# EAGLE design PIC32pcbSchematicJones (EAGLE 8.1.0)
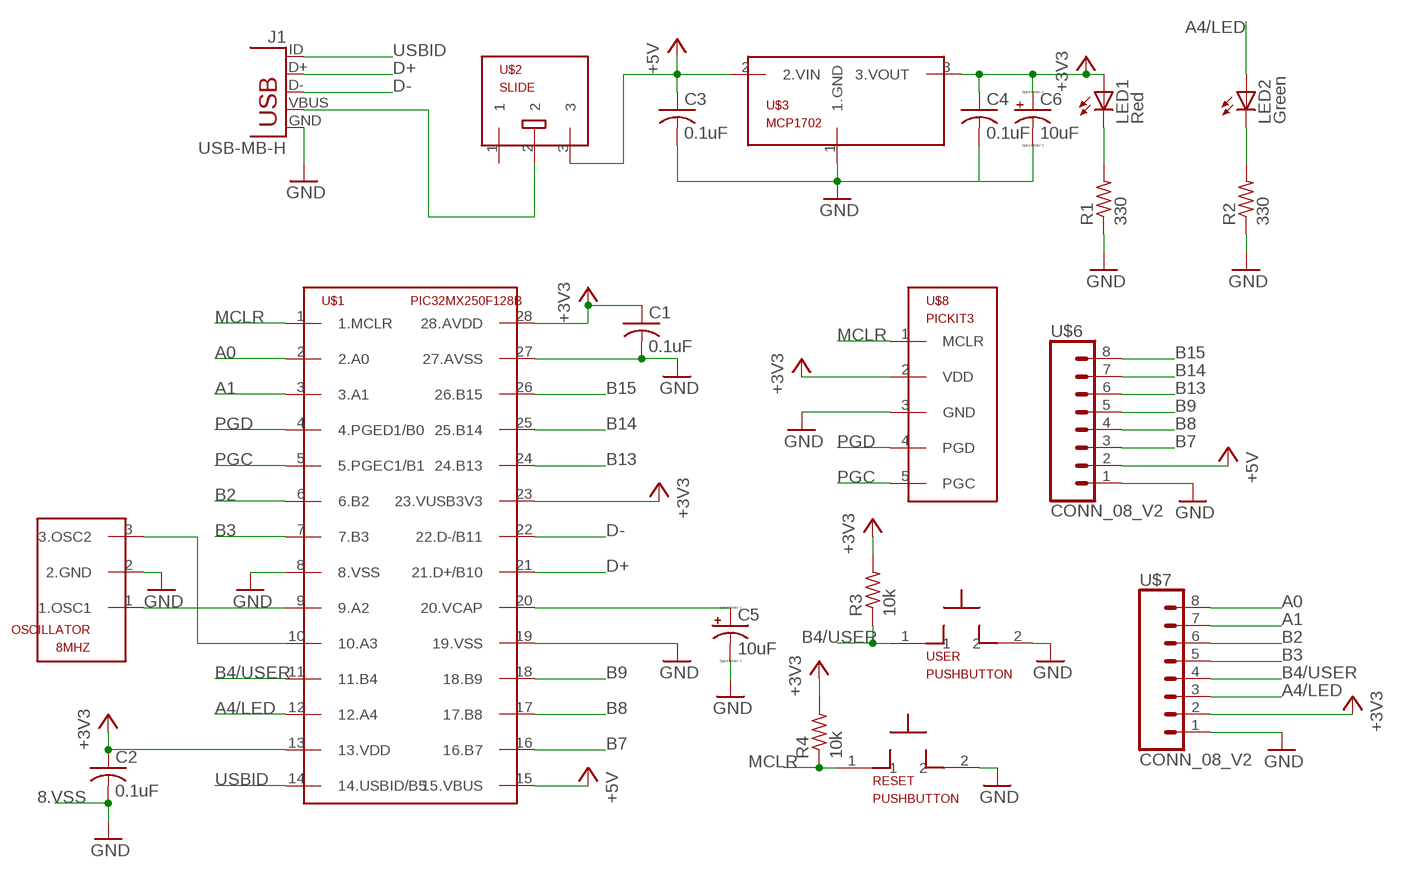
[diagram p0: schematic, sheet 1]

## Parts
8MHZ  OSCILLATOR  [OSCILLATOR]
C1  0.1uF  C-US025-025X050  [C025-025X050]
C2  0.1uF  C-US025-025X050  [C025-025X050]
C3  0.1uF  C-US025-025X050  [C025-025X050]
C4  0.1uF  C-US025-025X050  [C025-025X050]
C5  10uF  CPOL-USB45181B  [B45181B]
C6  10uF  CPOL-USB45181B  [B45181B]
J1  USB-MB-H  [USB-MB-H]
LED1  Red  LED3MM  [LED3MM]
LED2  Green  LED3MM  [LED3MM]
R1  330  R-US_0207/10  [0207/10]
R2  330  R-US_0207/10  [0207/10]
R3  10k  R-US_0207/10  [0207/10]
R4  10k  R-US_0207/10  [0207/10]
RESET  PUSHBUTTON  [PUSHBUTTON]
U$1  PIC32MX250F128B  [DIL28-3]
U$2  SLIDE  [SLIDE]
U$3  MCP1702  [TO92]
U$6  CONN_08_V2  [1X08]
U$7  CONN_08_V2  [1X08]
U$8  PICKIT3  [1X05]
USER  PUSHBUTTON  [PUSHBUTTON]

## Nets
8.VSS: C2.2 ; supply symbol labelled GND
+3V3: C1.1 C2.1 C4.1 C6.+ LED1.A R3.2 R4.2 U$1.13(13.VDD) U$1.23(23.VUSB3V3) U$1.28(28.AVDD) U$3.3(3.VOUT) U$7.2 U$8.2(VDD)
+5V: C3.1 U$1.15(15.VBUS) U$2.3 U$3.2(2.VIN) U$6.2
A0: U$1.2(2.A0) U$7.8
A1: U$1.3(3.A1) U$7.7
A4/LED: LED2.A U$1.12(12.A4) U$7.3
B2: U$1.6(6.B2) U$7.6
B3: U$1.7(7.B3) U$7.5
B4/USER: R3.1 U$1.11(11.B4) U$7.4 USER.1
B7: U$1.16(16.B7) U$6.3
B8: U$1.17(17.B8) U$6.4
B9: U$1.18(18.B9) U$6.5
B13: U$1.24(24.B13) U$6.6
B14: U$1.25(25.B14) U$6.7
B15: U$1.26(26.B15) U$6.8
D+: J1.D+ U$1.21(21.D+/B10)
D-: J1.D- U$1.22(22.D-/B11)
GND: 8MHZ.2(2.GND) C1.2 C3.2 C5.- C6.- J1.GND R1.1 R2.1 RESET.2 U$1.8(8.VSS) U$1.19(19.VSS) U$1.27(27.AVSS) U$3.1(1.GND) U$6.1 U$7.1 U$8.3(GND) USER.2
MCLR: R4.1 RESET.1 U$1.1(1.MCLR) U$8.1(MCLR)
N$1: LED2.K(C) R2.2
N$2: 8MHZ.1(1.OSC1) U$1.9(9.A2)
N$3: 8MHZ.3(3.OSC2) U$1.10(10.A3)
N$4: C5.+ U$1.20(20.VCAP)
N$5: LED1.K(C) R1.2
N$6: C4.2
PGC: U$1.5(5.PGEC1/B1) U$8.5(PGC)
PGD: U$1.4(4.PGED1/B0) U$8.4(PGD)
USBID: J1.ID U$1.14(14.USBID/B5)
VBUS: J1.VBUS U$2.2
Unconnected: U$2.1

## Library data of the parts
8MHZ = PIC32_PCB_Jones_433:OSCILLATOR
C1-C4 = PIC32_PCB_Jones_433:C-US: CAPACITOR, American symbol
C5 C6 = PIC32_PCB_Jones_433:CPOL-US: POLARIZED CAPACITOR, American symbol
J1 = PIC32_PCB_Jones_433:USB: USB Connectors USB-B-PTH is fully proven SKU : PRT-00139/CONN-08278 USB-miniB is fully proven SKU : PRT-00587 USB-A-PCB is untested. USB-A-H is throughly reviewed, but untested. Spark Fun Electronics SKU : PRT-00437 USB-B-SMT is throughly reviewed, but untested. Needs silkscreen touching up. USB-A-S has not been used/tested USB-MB-H has not been used/tested USB-MICROB has been used. CONN-09505
LED1 LED2 = PIC32_PCB_Jones_433:LED: LED OSRAM: - CHIPLED LG R971, LG N971, LY N971, LG Q971, LY Q971, LO R971, LY R971 LH N974, LH R974 LS Q976, LO Q976, LY Q976 LO Q996 - Hyper CHIPLED LW Q18S LB Q993, LB Q99A, LB R99A - SideLED LS A670, LO A670, LY A670, LG A670, LP A670 LB A673, LV A673, LT A673, LW A673 LH A674 LY A675 LS A676, LA A676, LO A676, LY A676, LW A676 LS A679, LY A679, LG A679 - Hyper Micro SIDELED® LS Y876, LA Y876, LO Y876, LY Y876 LT Y87S - SmartLED LW L88C, LW L88S LB L89C, LB L89S, LG L890 LS L89K, LO L89K, LY L89K LS L896, LA L896, LO L896, LY L896 - TOPLED LS T670, LO T670, LY T670, LG T670, LP T670 LSG T670, LSP T670, LSY T670, LOP T670, LYG T670 LG T671, LOG T671, LSG T671 LB T673, LV T673, LT T673, LW T673 LH T674 LS T676, LA T676, LO T676, LY T676, LB T676, LH T676, LSB T676, LW T676 LB T67C, LV T67C, LT T67C, LS T67K, LO T67K, LY T67K, LW E67C LS E67B, LA E67B, LO E67B, LY E67B, LB E67C, LV E67C, LT E67C LW T67C LS T679, LY T679, LG T679 LS T770, LO T770, LY T770, LG T770, LP T770 LB T773, LV T773, LT T773, LW T773 LH T774 LS E675, LA E675, LY E675, LS T675 LS T776, LA T776, LO T776, LY T776, LB T776 LHGB T686 LT T68C, LB T68C - Hyper Mini TOPLED® LB M676 - Mini TOPLED Santana® LG M470 LS M47K, LO M47K, LY M47K Source: http://www.osram.convergy.de LUXEON: - LUMILED® LXK2-PW12-R00, LXK2-PW12-S00, LXK2-PW14-U00, LXK2-PW14-V00 LXK2-PM12-R00, LXK2-PM12-S00, LXK2-PM14-U00 LXK2-PE12-Q00, LXK2-PE12-R00, LXK2-PE12-S00, LXK2-PE14-T00, LXK2-PE14-U00 LXK2-PB12-K00, LXK2-PB12-L00, LXK2-PB12-M00, LXK2-PB14-N00, LXK2-PB14-P00, LXK2-PB14-Q00 LXK2-PR12-L00, LXK2-PR12-M00, LXK2-PR14-Q00, LXK2-PR14-R00 LXK2-PD12-Q00, LXK2-PD12-R00, LXK2-PD12-S00 LXK2-PH12-R00, LXK2-PH12-S00 LXK2-PL12-P00, LXK2-PL12-Q00, LXK2-PL12-R00 Source: www.luxeon.com KINGBRIGHT: KA-3528ASYC Source: www.kingbright.com
R1-R4 = PIC32_PCB_Jones_433:R-US_: RESISTOR, American symbol
RESET USER = PIC32_PCB_Jones_433:PUSHBUTTON
U$1 = PIC32_PCB_Jones_433:PIC32MX250F128B
U$2 = PIC32_PCB_Jones_433:SLIDE
U$3 = PIC32_PCB_Jones_433:MCP1702
U$6 U$7 = PIC32_PCB_Jones_433:CONN_08_V2
U$8 = PIC32_PCB_Jones_433:PICKIT3

## Board
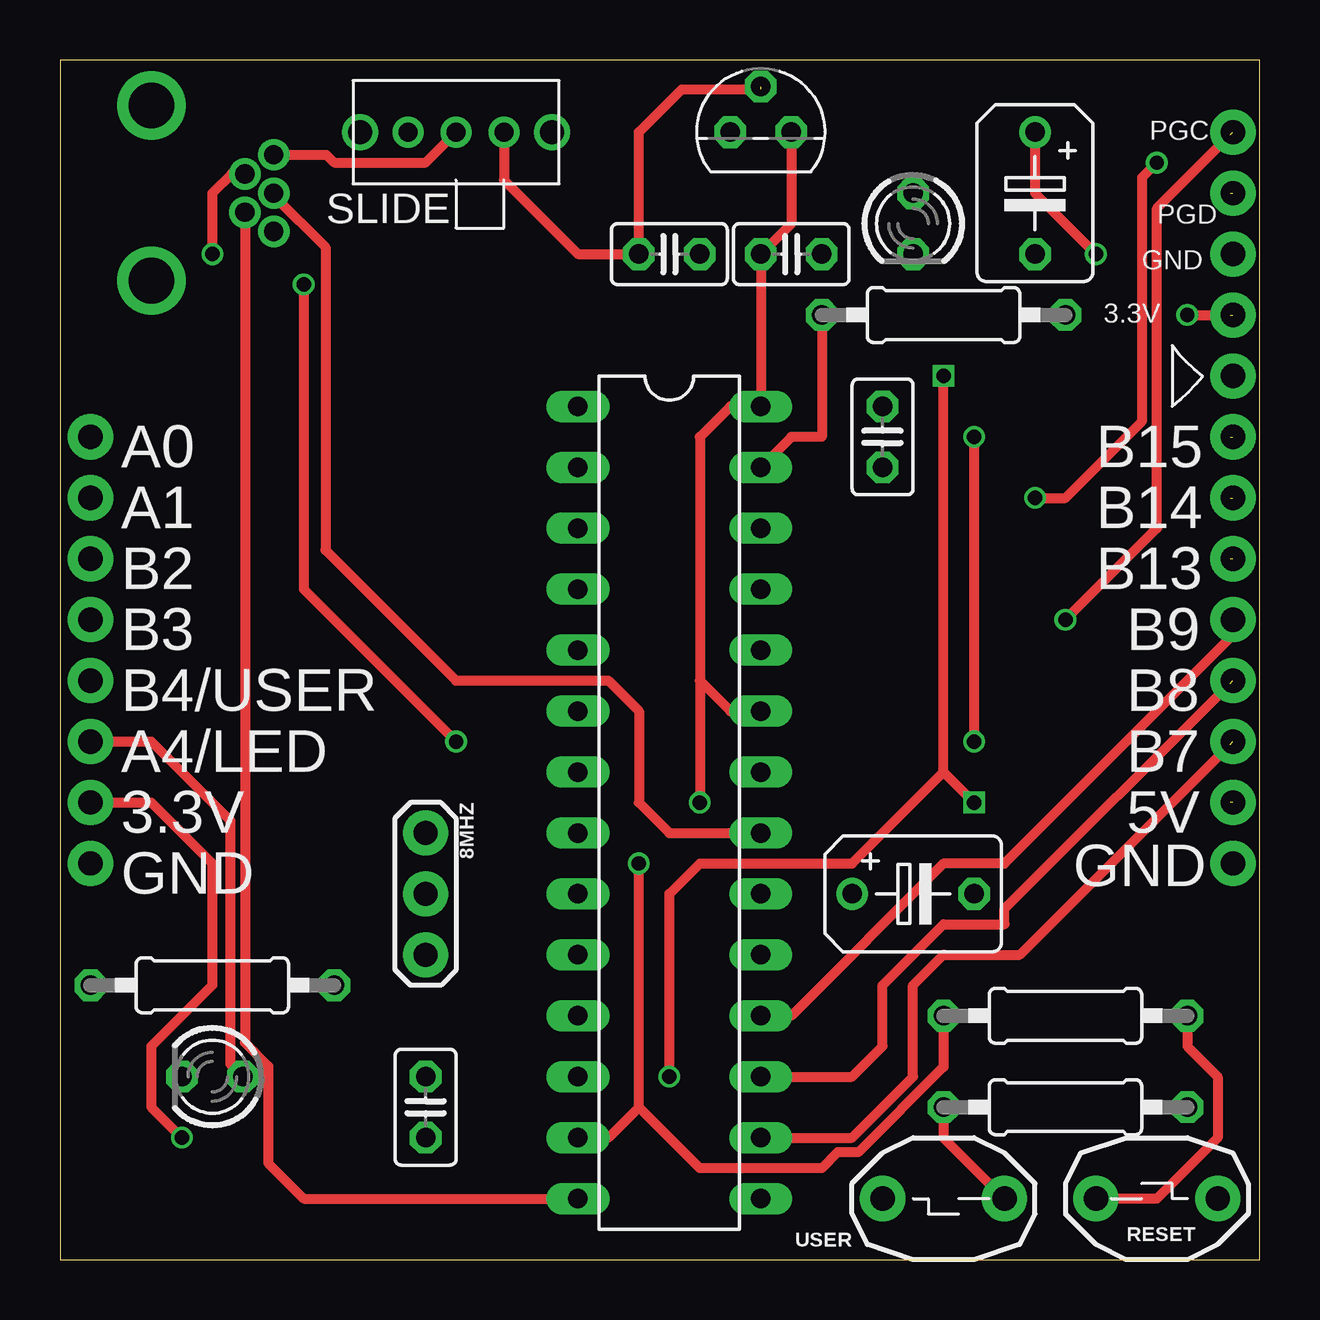
[diagram p1: board, top side]
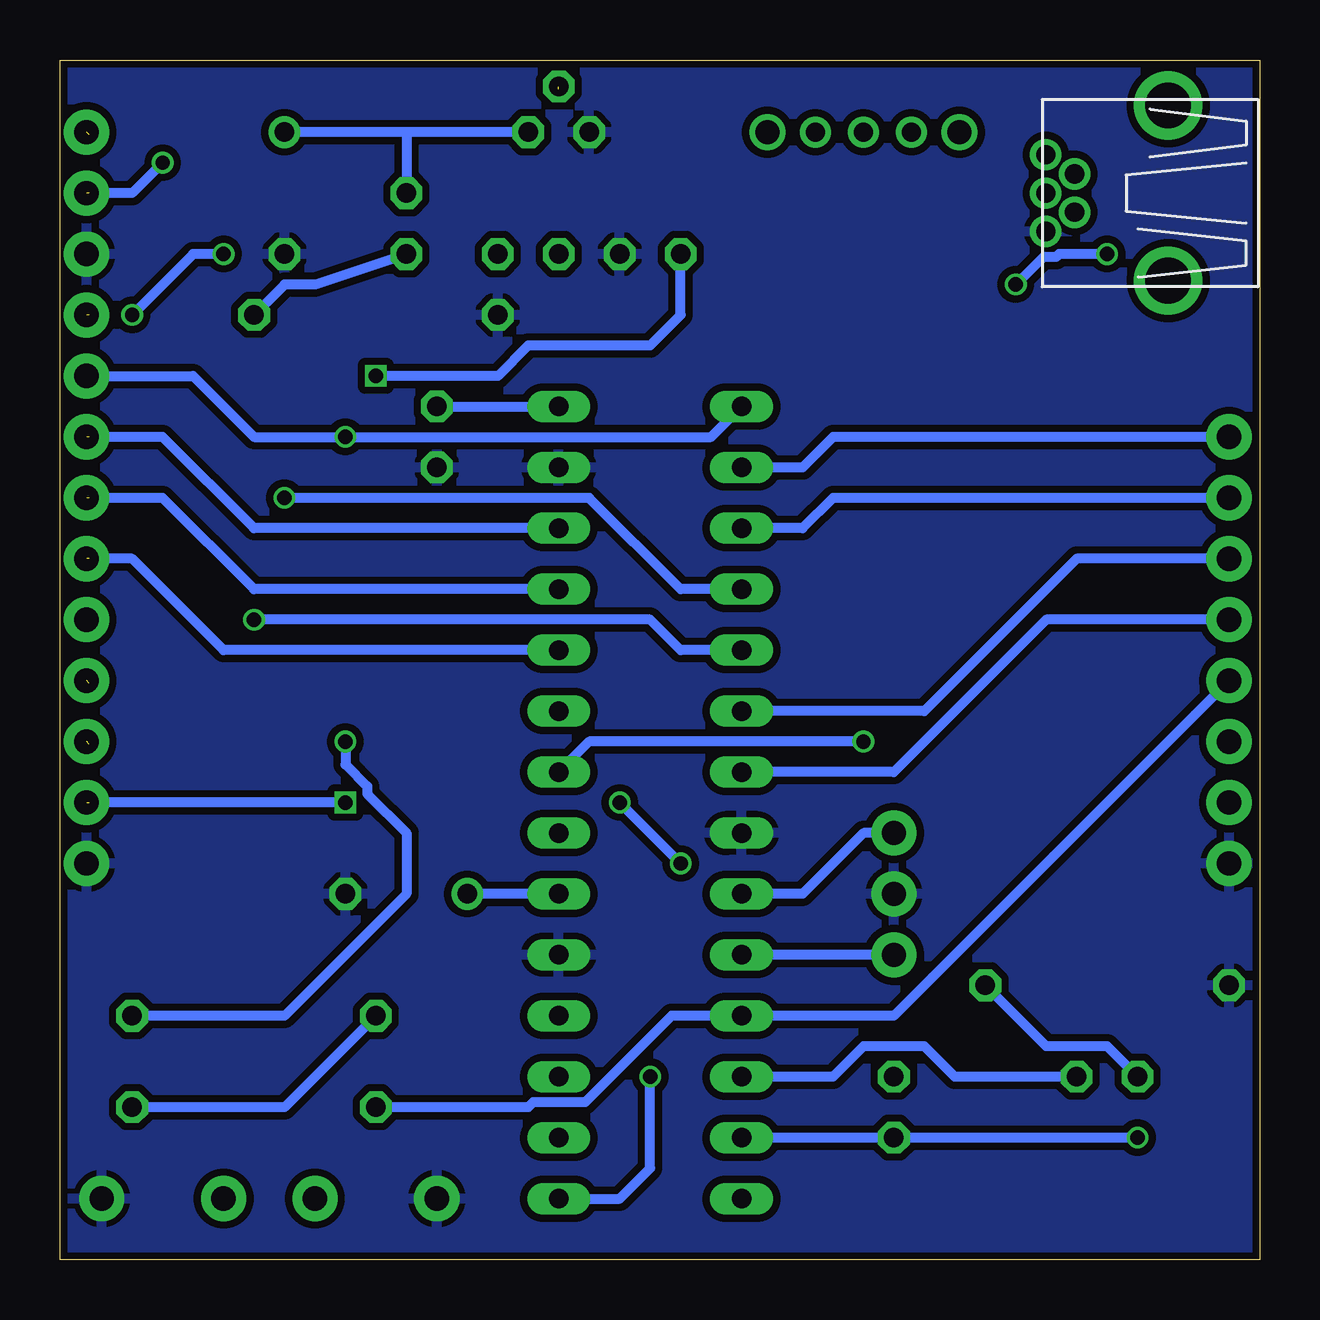
[diagram p2: board, bottom side, seen from below]

Size 50 x 50 mm. Coordinates in mm from the lower left corner, seen from the top.
Outline: 0,0 50,0 50,50 0,50 0,0
Copper layers (1*16): Top 0.035mm / dielectric 1.5mm / Bottom 0.035mm
Design rules "SeeedStudio_2layer_DRU_no_angle_20140221": minimum track width 6mil, minimum drill 12mil, track to track 6mil, track to pad 6mil, pad to pad 6mil, via to via 6mil, smd to smd 0mil, copper to edge 10mil, drill to drill 10mil, minimum pad ring 10mil, minimum via ring 6mil, stop-mask expansion 2mil, vias tented up to drill 100mil, thermal gap 10mil

### Footprints (pad centres in the part's own frame; a part is rotated, then mirrored left to right if it is on the bottom)
OSCILLATOR = drill 1.016 pad 1.88: 1 -2.54,0; 2 0,0; 3 2.54,0
C025-025X050 = drill 0.813 octagon: 1 -1.27,0; 2 1.27,0
B45181B = drill 0.813: + -2.54,0 | drill 0.813 octagon: - 2.54,0
USB-MB-H = drill 0.8: D+ 5.1,0; D- 3.9,0.8; GND 5.1,-1.6; ID 3.9,-0.8; VBUS 5.1,1.6 | drill 1.9: P$6 0,-3.65; P$7 0,3.65
LED3MM = drill 0.813 octagon: A -1.27,0; K 1.27,0
0207/10 = drill 0.813 octagon: 1 -5.08,0; 2 5.08,0
PUSHBUTTON = drill 1.016 pad 1.88: 1 -2.54,0; 2 2.54,0
DIL28-3 = drill 0.813 long: 1 -16.51,-3.81; 2 -13.97,-3.81; 3 -11.43,-3.81; 4 -8.89,-3.81; 5 -6.35,-3.81; 6 -3.81,-3.81; 7 -1.27,-3.81; 8 1.27,-3.81; 9 3.81,-3.81; 10 6.35,-3.81; 11 8.89,-3.81; 12 11.43,-3.81; 13 13.97,-3.81; 14 16.51,-3.81; 15 16.51,3.81; 16 13.97,3.81; 17 11.43,3.81; 18 8.89,3.81; 19 6.35,3.81; 20 3.81,3.81; 21 1.27,3.81; 22 -1.27,3.81; 23 -3.81,3.81; 24 -6.35,3.81; 25 -8.89,3.81; 26 -11.43,3.81; 27 -13.97,3.81; 28 -16.51,3.81
SLIDE = drill 0.8: 1 -2,0; 2 0,0; 3 2,0 | drill 1: P$1 -4,0; P$2 4,0
TO92 = drill 0.813 octagon: 1 -1.27,0; 2 0,1.905; 3 1.27,0
1X08 = drill 1.016 pad 1.88: 1 0,0; 2 2.54,0; 3 5.08,0; 4 7.62,0; 5 10.16,0; 6 12.7,0; 7 15.24,0; 8 17.78,0
1X05 = drill 1.016 pad 1.88: 1 0,0; 2 2.54,0; 3 5.08,0; 4 7.62,0; 5 10.16,0

### Placement (x,y rotation side)
8MHZ  15.24,15.24 270 top
C1  34.29,34.29 270 top
C2  15.24,6.35 90 top
C3  25.4,41.91 0 top
C4  30.48,41.91 0 top
C5  35.56,15.24 0 top
C6  40.64,44.45 270 top
J1  3.81,44.45 0 top
LED1  35.56,43.18 270 top
LED2  6.35,7.62 180 top
R1  36.83,39.37 0 top
R2  6.35,11.43 0 top
R3  41.91,6.35 0 top
R4  41.91,10.16 180 top
RESET  45.72,2.54 0 top
U$1  25.4,19.05 270 top
U$2  16.51,46.99 0 top
U$3  29.21,46.99 0 top
U$6  48.9,16.51 90 top
U$7  1.27,16.51 90 top
U$8  48.9,36.83 90 top
USER  36.83,2.54 180 top

### Tracks (layer width: path | path; a pad name or v marks a point on that pad's centre or on a via)
+3V3  (via drill 0.6)  (1 unrouted)
  Top 0.406: U$3.3 30.48,43.18 C4.1 U$1.28 27.94,35.56 26.67,34.29 26.67,24.13 | U$7.2 3.81,19.05 6.35,16.51 6.35,11.43 3.81,8.89 3.81,6.35 v5.08,5.08 | U$1.23 27.94,22.86 26.67,24.13 | 26.67,24.13 v26.67,19.05 | 24.13,6.35 v24.13,16.51 | 24.13,6.35 22.86,5.08 U$1.13 | R4.2 36.83,8.03 33.27,4.47 32.41,4.47 31.75,3.81 26.67,3.81 24.13,6.35 | C6.+ 40.64,44.45 v43.18,41.91 | v46.99,39.37 48.78,39.37
  Bottom 0.406: U$3.3 35.56,46.99 | 35.56,46.99 C6.+ | 35.56,46.99 LED1.A | C1.1 U$1.28 | U$1.13 C2.1 v5.08,5.08 | R4.2 40.64,6.35 R3.2 | v26.67,19.05 v24.13,16.51 | v43.18,41.91 44.45,41.91 v46.99,39.37
+5V  (via drill 0.6)  (2 unrouted)
  Top 0.406: U$2.3 18.51,44.99 21.59,41.91 C3.1 24.13,46.99 25.92,48.78 29.21,48.78 | 36.83,20.32 v36.83,36.83 | 36.83,20.32 v38.1,19.05 | v25.4,7.62 25.4,15.24 26.67,16.51 33.02,16.51 36.83,20.32
  Bottom 0.406: C3.1 24.13,39.37 25.4,38.1 30.48,38.1 31.75,36.83 v36.83,36.83 | v38.1,19.05 48.78,19.05 | U$1.15 26.67,2.54 25.4,3.81 v25.4,7.62
A0
  Bottom 0.406: U$7.8 17.78,34.29 19.05,33.02 U$1.2
A1
  Bottom 0.406: U$1.3 19.05,30.48 17.78,31.75 U$7.7
A4/LED
  Top 0.406: U$7.3 3.81,21.59 7.1,18.3 7.1,8.14 LED2.A
  Bottom 0.406: LED2.A 12.7,7.62 13.97,8.89 16.51,8.89 17.78,7.62 U$1.12
B2
  Bottom 0.406: U$7.6 7.62,29.21 13.97,22.86 U$1.6
B3
  Bottom 0.406: U$7.5 8.89,26.67 15.24,20.32 U$1.7
B4/USER
  Top 0.406: R3.1 36.83,5.08 USER.1
  Bottom 0.406: U$7.4 15.24,10.16 U$1.11 24.5,10.16 28.11,6.55 30.28,6.55 30.48,6.35 R3.1
B7  (1 unrouted)
  Top 0.406: U$1.16 33.02,5.08 35.56,7.62 35.56,11.43 36.83,12.7 40.01,12.7 48.78,21.48
B8  (1 unrouted)
  Top 0.406: U$1.17 33.02,7.62 34.29,8.89 34.29,11.43 36.83,13.97 39.37,13.97 39.37,14.61 48.78,24.02
B9
  Top 0.406: U$6.5 48.9,26.04 39.37,16.51 36.83,16.51 30.48,10.16 U$1.18
B13  (1 unrouted)
  Bottom 0.406: U$1.24 43.18,25.4 46.99,29.21 48.78,29.21
B14  (1 unrouted)
  Bottom 0.406: 48.26,31.75 48.78,31.75 45.72,31.75 41.91,27.94 U$1.25
B15  (1 unrouted)
  Bottom 0.406: U$1.26 41.91,30.48 45.72,34.29 48.78,34.29
D+
  Top 0.406: J1.D+ 8.91,44.35 11.07,42.19 11.07,29.57 16.51,24.13 22.86,24.13 24.13,22.86 24.13,19.05 25.4,17.78 U$1.21
D-  (via drill 0.6)
  Top 0.406: J1.D- 7.15,45.25 6.35,44.45 v6.35,41.91 | v10.16,40.64 10.16,27.94 v16.51,21.59
  Bottom 0.406: v6.35,41.91 8.35,41.91 8.47,41.79 9.01,41.79 v10.16,40.64 | v16.51,21.59 27.94,21.59 U$1.22
GND
  Top 0.406: R1.1 31.75,34.29 30.48,34.29 U$1.27
  pour Bottom (isolate 0.305): 0,50.16 49.85,50.16 49.85,49.85 50.16,49.85 50.16,0 0,0
MCLR  (via drill 0.6)
  Top 0.406: R4.1 46.99,8.89 48.26,7.62 48.26,5.08 45.72,2.54 RESET.1 | v38.1,34.29 v38.1,21.59
  Bottom 0.406: U$8.1 44.45,36.83 41.91,34.29 v38.1,34.29 22.86,34.29 U$1.1 | v38.1,21.59 38.1,20.63 37.19,19.72 37.19,19.41 35.56,17.78 35.56,15.24 40.64,10.16 R4.1
N$1
  Bottom 0.406: LED2.K 6.35,8.89 8.89,8.89 R2.2
N$2
  Bottom 0.406: 8MHZ.1 16.51,17.78 19.05,15.24 U$1.9
N$3
  Bottom 0.406: 8MHZ.3 U$1.10
N$4
  Bottom 0.406: U$1.20 C5.+
N$5
  Bottom 0.406: LED1.K 39.37,40.64 40.64,40.64 R1.2
PGC  (via drill 0.6)  (1 unrouted)
  Top 0.406: v41.91,26.67 45.72,30.48 45.72,43.81 48.78,46.88
  Bottom 0.406: U$1.5 24.13,25.4 25.4,26.67 v41.91,26.67
PGD  (via drill 0.6)  (1 unrouted)
  Top 0.406: v40.64,31.75 41.91,31.75 45.11,34.95 45.11,45.11 v45.72,45.72
  Bottom 0.406: U$1.4 24.13,27.94 27.94,31.75 v40.64,31.75 | v45.72,45.72 46.99,44.45 48.78,44.45
USBID
  Top 0.406: J1.ID 7.71,9.04 8.69,8.06 8.69,4.01 10.16,2.54 U$1.14
VBUS
  Top 0.406: J1.VBUS 11.1,46.05 11.43,45.72 15.24,45.72 U$2.2

### Text on the board
tPlace: PGC | PGD | GND | 3.3V | A0 | B15 | A1 | B14 | B2 | B13 | B3 | B9 | B4/USER | B8 | A4/LED | B7 | 3.3V | 5V | GND | GND